# EAGLE board rtc (EAGLE 6.6.0), part 1 of 3
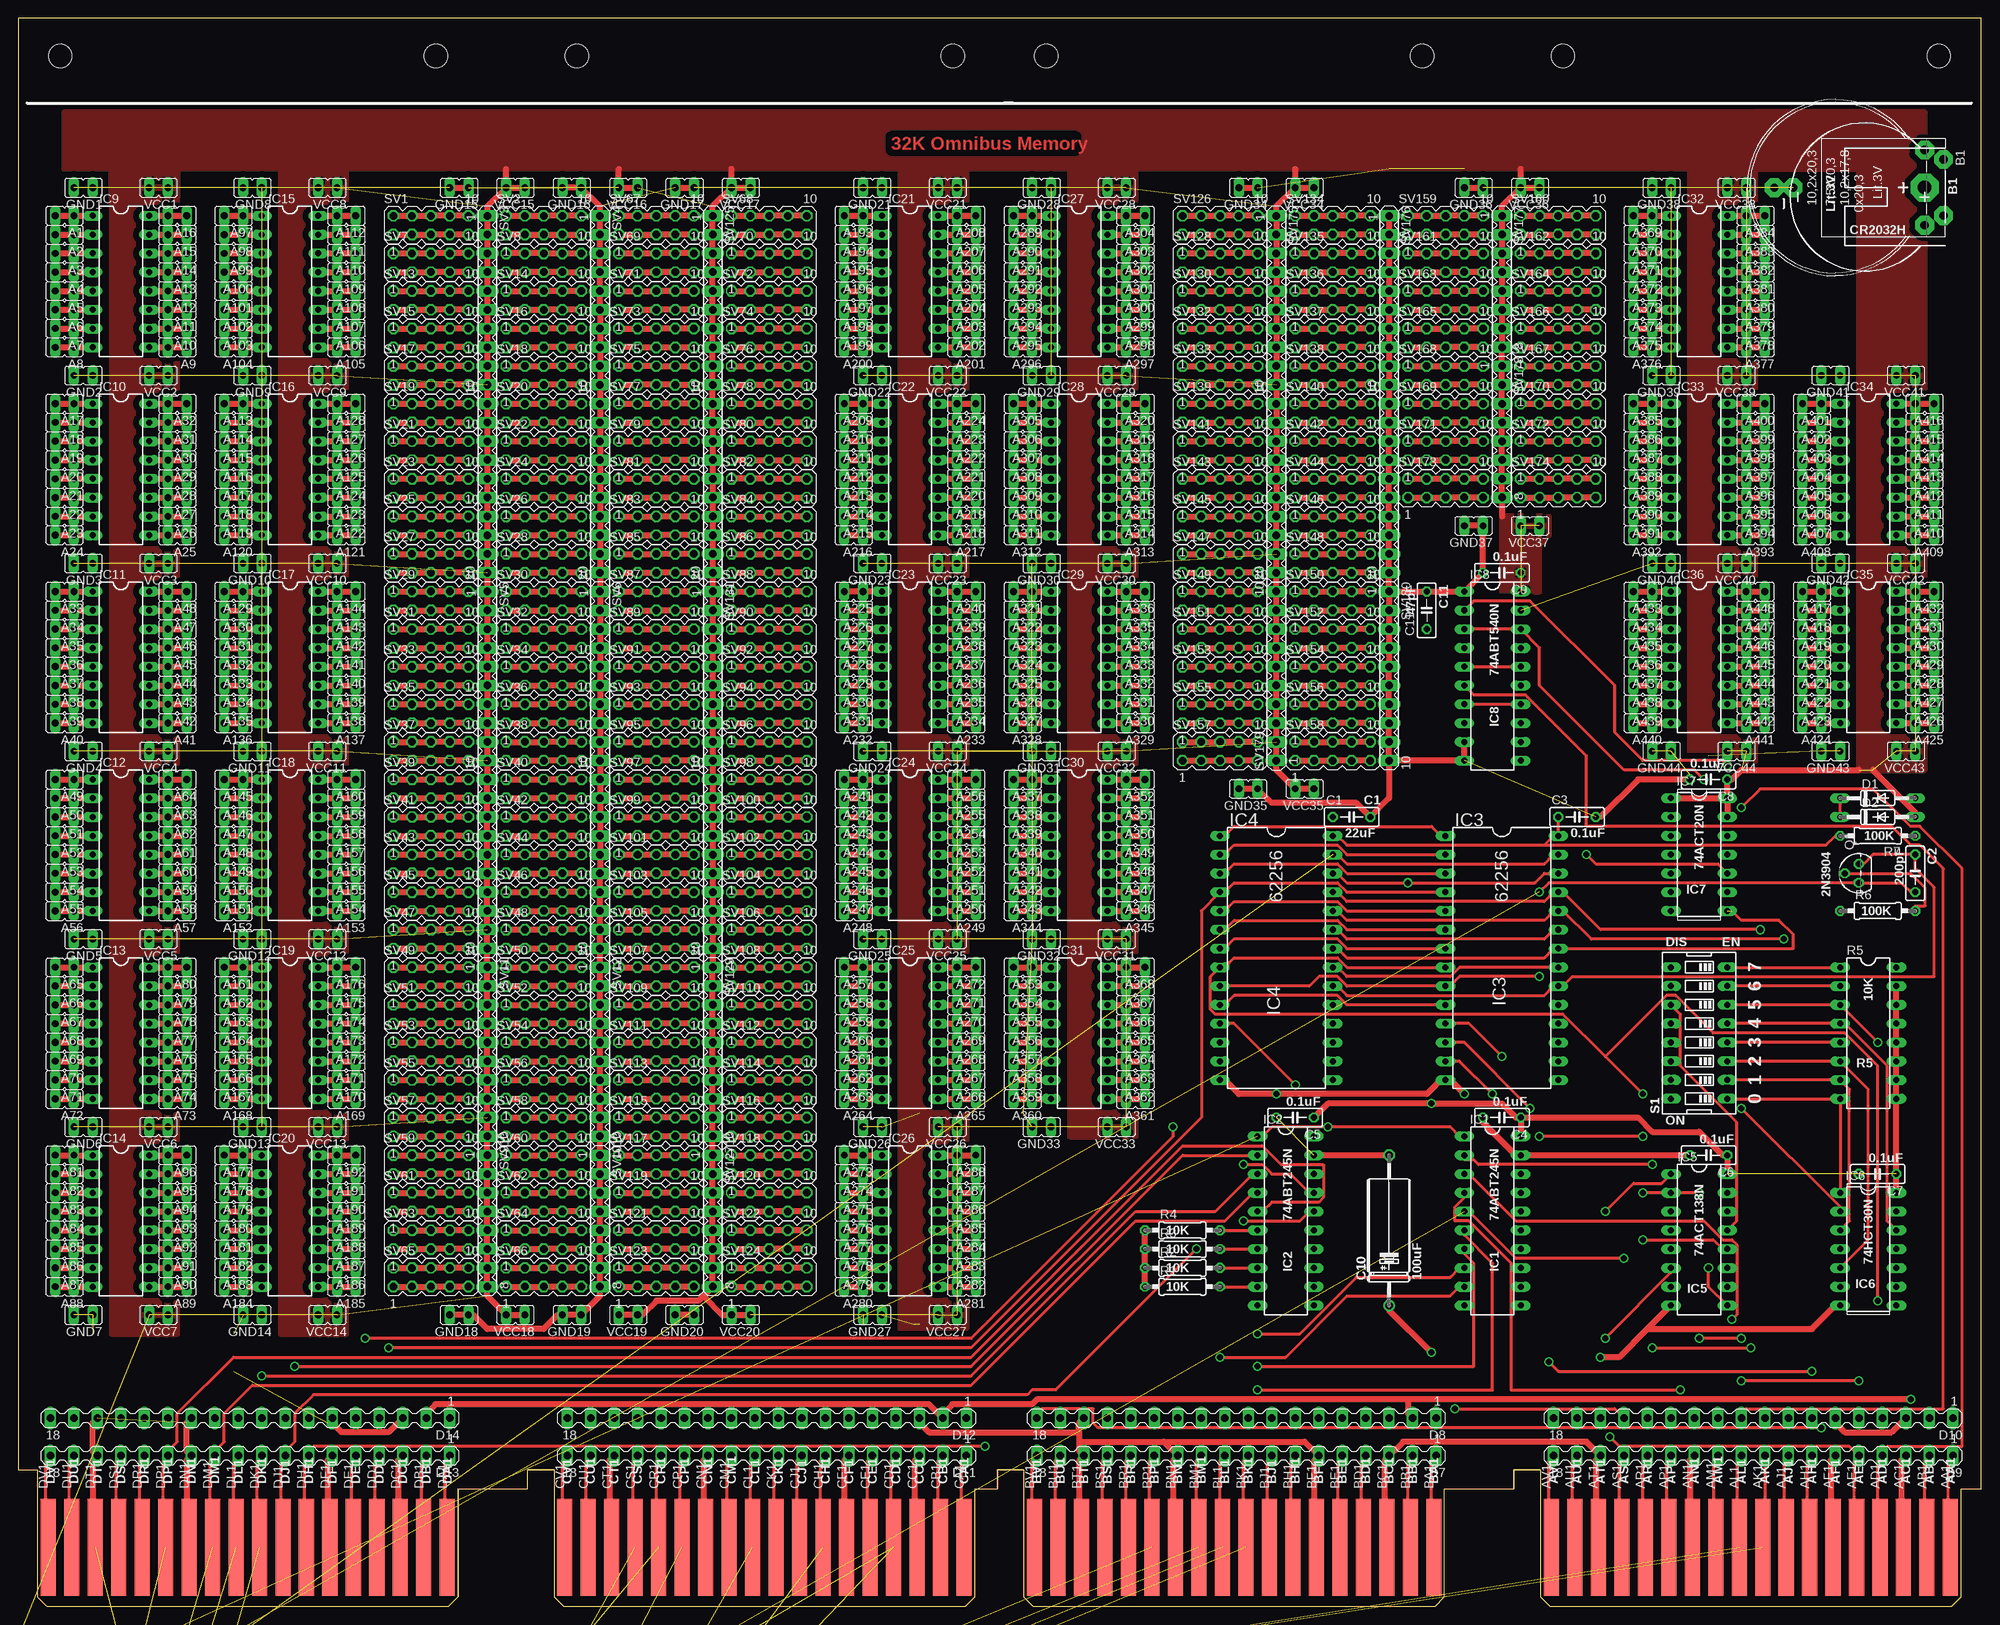
[diagram p6: board, top side]
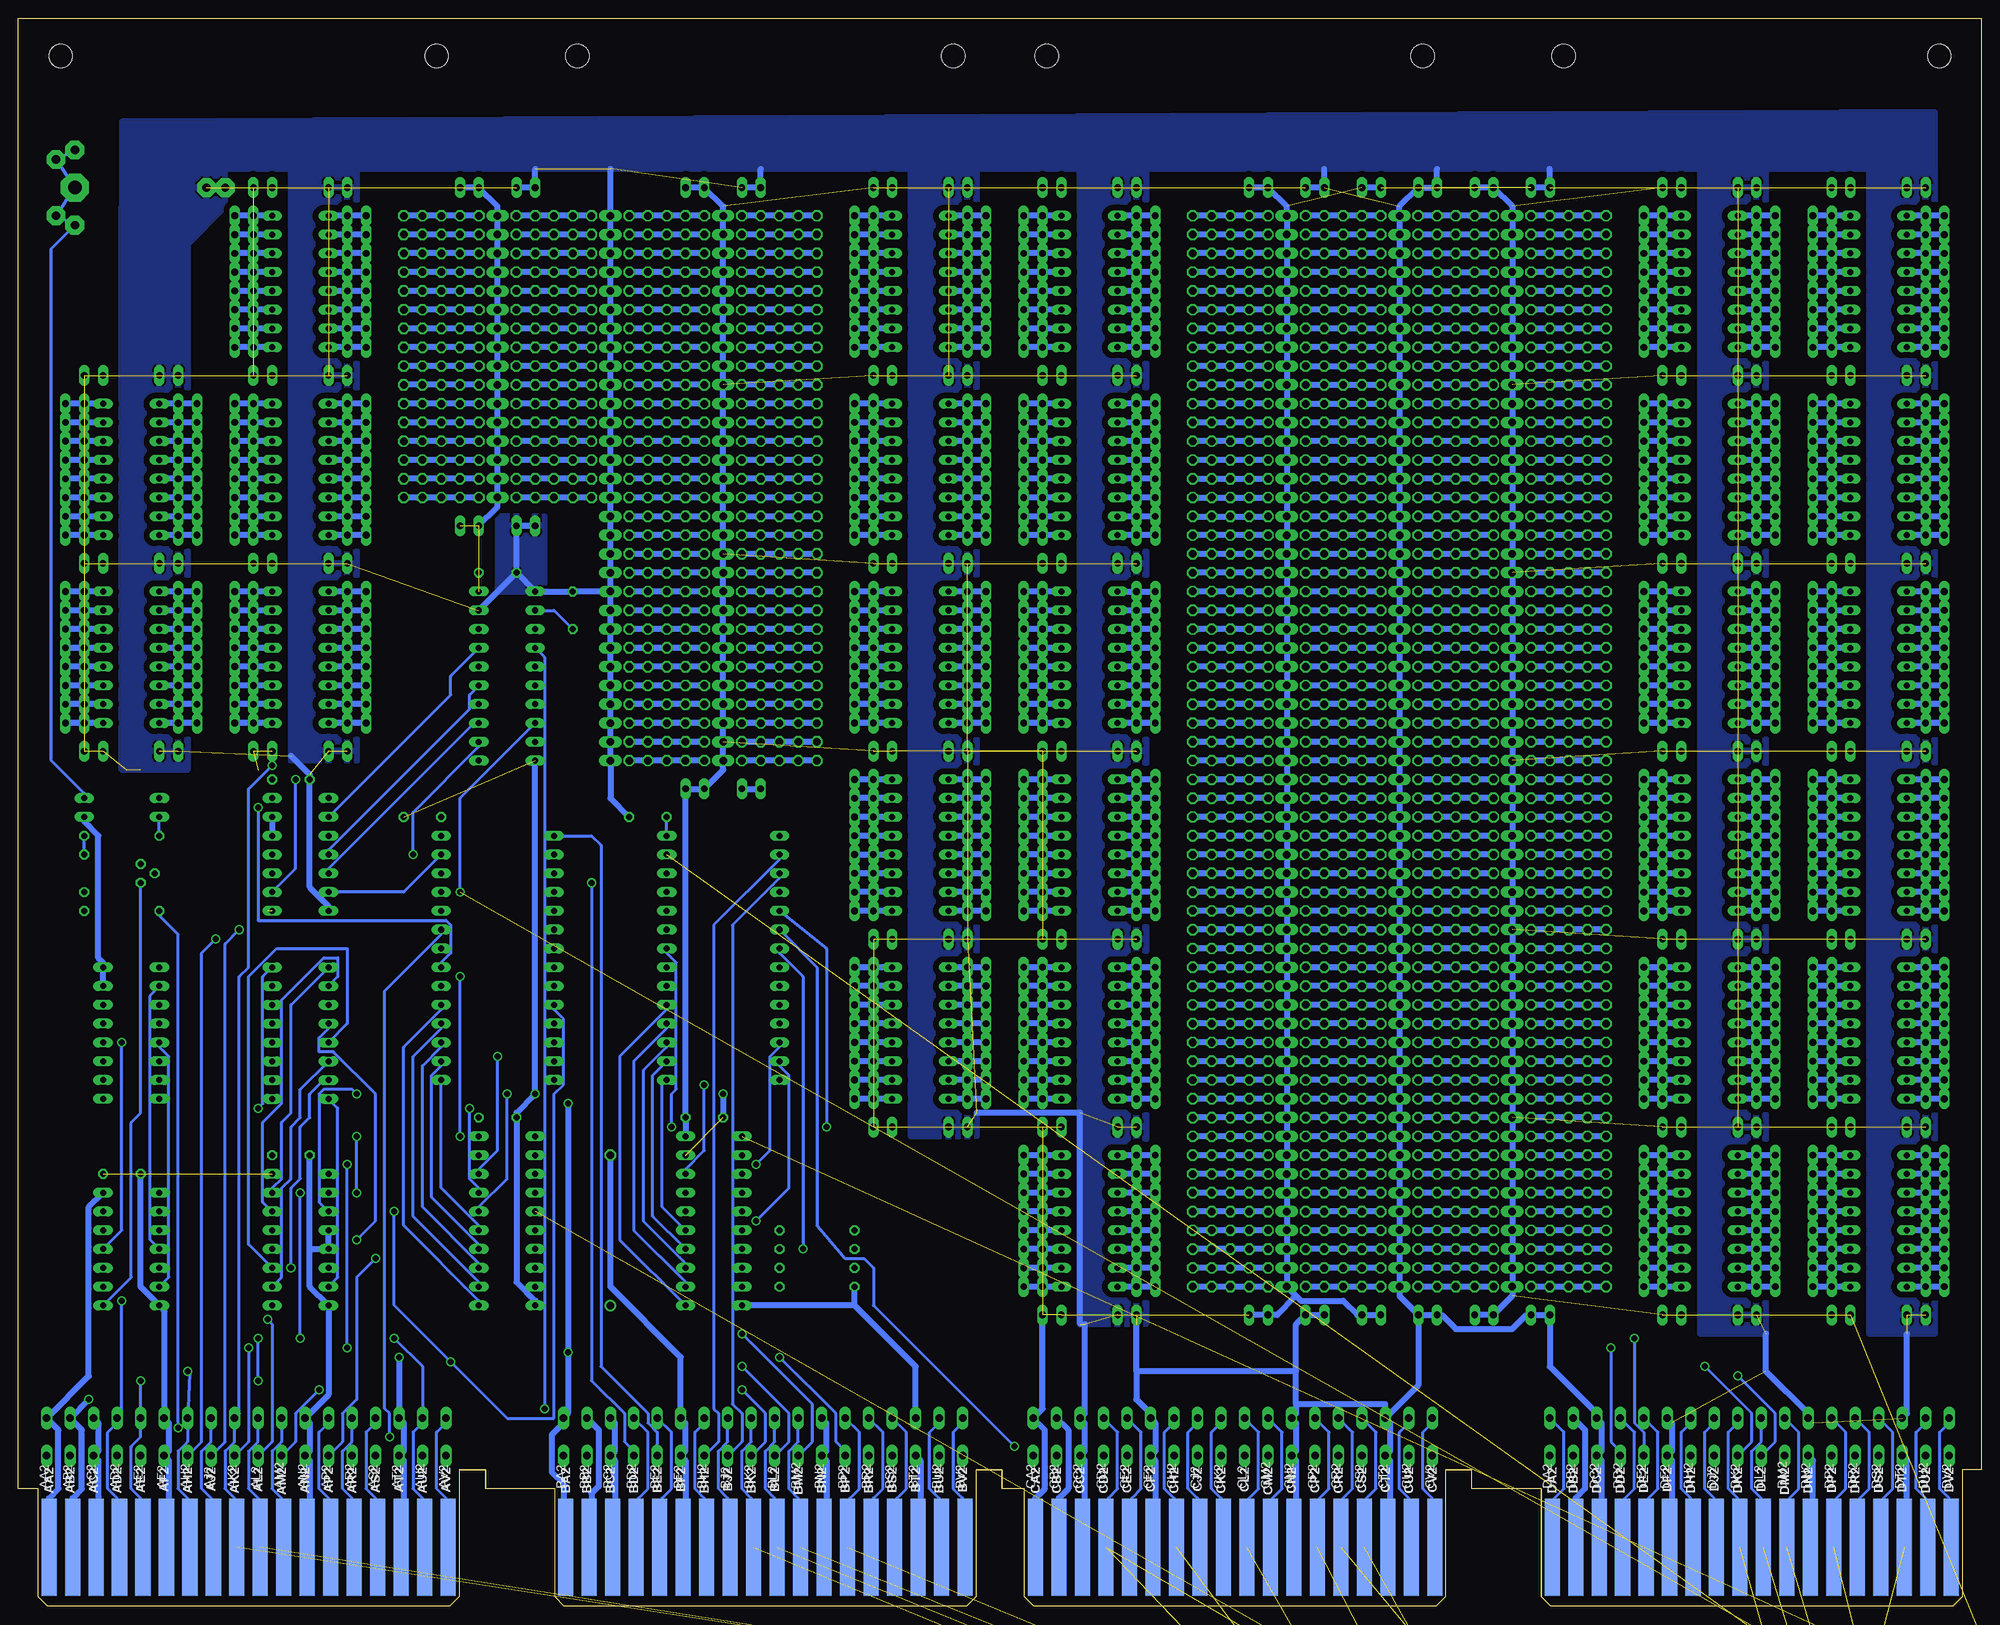
[diagram p7: board, bottom side, seen from below]

Size 265.3 x 214.63 mm. Coordinates in mm from the lower left corner, seen from the top.
Copper layers (1+16): Top 0.035mm / dielectric 1.5mm / Bottom 0.035mm
Design rules "16mils": minimum track width 16mil, minimum drill 32mil, track to track 15mil, track to pad 10mil, pad to pad 10mil, via to via 10mil, smd to smd 10mil, copper to edge 13mil, drill to drill 10mil, minimum pad ring 10mil, minimum via ring 8mil, stop-mask expansion 0mil, vias tented up to drill 0mil, thermal gap 10mil
Net classes: 1 supply: width 0.813 mm

## Footprints (pad centres in the part's own frame; a part is rotated, then mirrored left to right if it is on the bottom)
JP1 = drill 0.914 long: 1 0,-1.27; 2 0,1.27
B2430UNI = drill 1.118 pad 2.54 octagon: + 3.81,14.605; +@1 -3.81,14.605; +@2 -5.08,12.065; +@3 5.08,12.065; - 0,-5.715; -@1 0,-8.255 | drill 1.803 pad 3.81 octagon: +@4 0,12.065
C050-025X075 = drill 0.813 octagon: 1 -2.54,0; 2 2.54,0
E12-8 = drill 1.016: + -10.16,0 | drill 1.016 octagon: - 10.16,0
DO35-10 = drill 0.813 long: A 5.08,0; C -5.08,0
MA18-1 = drill 1.016 long: 1 -25.4,0; 2 -22.225,0; 3 -19.05,0; 4 -15.875,0; 5 -12.7,0; 6 -9.525,0; 7 -6.35,0; 8 -3.175,0; 9 0,0; 10 3.175,0; 11 6.35,0; 12 9.525,0; 13 12.7,0; 14 15.875,0; 15 19.05,0; 16 22.225,0; 17 25.4,0; 18 28.575,0
DIL20 = drill 0.813 long: 1 -11.43,-3.81; 2 -8.89,-3.81; 3 -6.35,-3.81; 4 -3.81,-3.81; 5 -1.27,-3.81; 6 1.27,-3.81; 7 3.81,-3.81; 8 6.35,-3.81; 9 8.89,-3.81; 10 11.43,-3.81; 11 11.43,3.81; 12 8.89,3.81; 13 6.35,3.81; 14 3.81,3.81; 15 1.27,3.81; 16 -1.27,3.81; 17 -3.81,3.81; 18 -6.35,3.81; 19 -8.89,3.81; 20 -11.43,3.81
DIL28-6 = drill 0.813 long: 1 -16.51,-7.62; 2 -13.97,-7.62; 3 -11.43,-7.62; 4 -8.89,-7.62; 5 -6.35,-7.62; 6 -3.81,-7.62; 7 -1.27,-7.62; 8 1.27,-7.62; 9 3.81,-7.62; 10 6.35,-7.62; 11 8.89,-7.62; 12 11.43,-7.62; 13 13.97,-7.62; 14 16.51,-7.62; 15 16.51,7.62; 16 13.97,7.62; 17 11.43,7.62; 18 8.89,7.62; 19 6.35,7.62; 20 3.81,7.62; 21 1.27,7.62; 22 -1.27,7.62; 23 -3.81,7.62; 24 -6.35,7.62; 25 -8.89,7.62; 26 -11.43,7.62; 27 -13.97,7.62; 28 -16.51,7.62
DIL16 = drill 0.813 long: 1 -8.89,-3.81; 2 -6.35,-3.81; 3 -3.81,-3.81; 4 -1.27,-3.81; 5 1.27,-3.81; 6 3.81,-3.81; 7 6.35,-3.81; 8 8.89,-3.81; 9 8.89,3.81; 10 6.35,3.81; 11 3.81,3.81; 12 1.27,3.81; 13 -1.27,3.81; 14 -3.81,3.81; 15 -6.35,3.81; 16 -8.89,3.81
DIL14 = drill 0.813 long: 1 -7.62,-3.81; 2 -5.08,-3.81; 3 -2.54,-3.81; 4 0,-3.81; 5 2.54,-3.81; 6 5.08,-3.81; 7 7.62,-3.81; 8 7.62,3.81; 9 5.08,3.81; 10 2.54,3.81; 11 0,3.81; 12 -2.54,3.81; 13 -5.08,3.81; 14 -7.62,3.81
DIL08 = drill 0.813 long: 1 -3.81,-3.81; 2 -1.27,-3.81; 3 1.27,-3.81; 4 3.81,-3.81; 5 3.81,3.81; 6 1.27,3.81; 7 -1.27,3.81; 8 -3.81,3.81
TO92 = drill 0.813 octagon: 1 1.27,0; 2 0,1.905; 3 -1.27,0
0207/10 = drill 0.813 octagon: 1 -5.08,0; 2 5.08,0
EDG-08 = drill 0.813 long: 1 -8.89,-3.81; 2 -6.35,-3.81; 3 -3.81,-3.81; 4 -1.27,-3.81; 5 1.27,-3.81; 6 3.81,-3.81; 7 6.35,-3.81; 8 8.89,-3.81; 9 8.89,3.81; 10 6.35,3.81; 11 3.81,3.81; 12 1.27,3.81; 13 -1.27,3.81; 14 -3.81,3.81; 15 -6.35,3.81; 16 -8.89,3.81
MA05-2 = drill 1.016 octagon: 1 -5.08,-1.27; 2 -5.08,1.27; 3 -2.54,-1.27; 4 -2.54,1.27; 5 0,-1.27; 6 0,1.27; 7 2.54,-1.27; 8 2.54,1.27; 9 5.08,-1.27; 10 5.08,1.27
MA20-1 = drill 1.016 long: 1 -24.13,0; 2 -21.59,0; 3 -19.05,0; 4 -16.51,0; 5 -13.97,0; 6 -11.43,0; 7 -8.89,0; 8 -6.35,0; 9 -3.81,0; 10 -1.27,0; 11 1.27,0; 12 3.81,0; 13 6.35,0; 14 8.89,0; 15 11.43,0; 16 13.97,0; 17 16.51,0; 18 19.05,0; 19 21.59,0; 20 24.13,0
MA08-1 = drill 1.016 long: 1 -8.89,0; 2 -6.35,0; 3 -3.81,0; 4 -1.27,0; 5 1.27,0; 6 3.81,0; 7 6.35,0; 8 8.89,0
MA10-1 = drill 1.016 long: 1 -11.43,0; 2 -8.89,0; 3 -6.35,0; 4 -3.81,0; 5 -1.27,0; 6 1.27,0; 7 3.81,0; 8 6.35,0; 9 8.89,0; 10 11.43,0
OMNIBUS = hole 3.175: 208.915,209.55; 259.715,209.55; 189.865,209.55; 139.065,209.55; 75.616,209.55; 126.416,209.55; 56.566,209.55; 5.766,209.55
EDGE-CON8 = smd 2.032 x 13.106: AA1 261.303,7.938; AB1 258.127,7.938; AC1 254.952,7.938; AD1 251.778,7.938; AE1 248.602,7.938; AF1 245.428,7.938; AH1 242.252,7.938; AJ1 239.077,7.938; AK1 235.903,7.938; AL1 232.727,7.938; AM1 229.553,7.938; AN1 226.377,7.938; AP1 223.202,7.938; AR1 220.028,7.938; AS1 216.852,7.938; AT1 213.678,7.938; AU1 210.502,7.938; AV1 207.327,7.938; BA1 191.452,7.938; BB1 188.278,7.938; BC1 185.102,7.938; BD1 181.928,7.938; BE1 178.752,7.938; BF1 175.577,7.938; BH1 172.403,7.938; BJ1 169.227,7.938; BK1 166.053,7.938; BL1 162.877,7.938; BM1 159.702,7.938; BN1 156.528,7.938; BP1 153.352,7.938; BR1 150.178,7.938; BS1 147.002,7.938; BT1 143.827,7.938; BU1 140.653,7.938; BV1 137.477,7.938; CA1 127.953,7.938; CB1 124.778,7.938; CC1 121.603,7.938; CD1 118.427,7.938; CE1 115.252,7.938; CF1 112.078,7.938; CH1 108.903,7.938; CJ1 105.728,7.938; CK1 102.552,7.938; CL1 99.377,7.938; CM1 96.203,7.938; CN1 93.028,7.938; CP1 89.853,7.938; CR1 86.677,7.938; CS1 83.502,7.938; CT1 80.328,7.938; CU1 77.153,7.938; CV1 73.978,7.938; DA1 58.102,7.938; DB1 54.928,7.938; DC1 51.752,7.938; DD1 48.578,7.938; DE1 45.403,7.938; DF1 42.227,7.938; DH1 39.053,7.938; DJ1 35.877,7.938; DK1 32.703,7.938; DL1 29.527,7.938; DM1 26.352,7.938; DN1 23.177,7.938; DP1 20.003,7.938; DR1 16.828,7.938; DS1 13.652,7.938; DT1 10.477,7.938; DU1 7.303,7.938; DV1 4.128,7.938 | smd 2.032 x 13.106 bottom: AA2 261.303,7.938; AB2 258.127,7.938; AC2 254.952,7.938; AD2 251.778,7.938; AE2 248.602,7.938; AF2 245.428,7.938; AH2 242.252,7.938; AJ2 239.077,7.938; AK2 235.903,7.938; AL2 232.727,7.938; AM2 229.553,7.938; AN2 226.377,7.938; AP2 223.202,7.938; AR2 220.028,7.938; AS2 216.852,7.938; AT2 213.678,7.938; AU2 210.502,7.938; AV2 207.327,7.938; BA2 191.452,7.938; BB2 188.278,7.938; BC2 185.102,7.938; BD2 181.928,7.938; BE2 178.752,7.938; BF2 175.577,7.938; BH2 172.403,7.938; BJ2 169.227,7.938; BK2 166.053,7.938; BL2 162.877,7.938; BM2 159.702,7.938; BN2 156.528,7.938; BP2 153.352,7.938; BR2 150.178,7.938; BS2 147.002,7.938; BT2 143.827,7.938; BU2 140.653,7.938; BV2 137.477,7.938; CA2 127.953,7.938; CB2 124.778,7.938; CC2 121.603,7.938; CD2 118.427,7.938; CE2 115.252,7.938; CF2 112.078,7.938; CH2 108.903,7.938; CJ2 105.728,7.938; CK2 102.552,7.938; CL2 99.377,7.938; CM2 96.203,7.938; CN2 93.028,7.938; CP2 89.853,7.938; CR2 86.677,7.938; CS2 83.502,7.938; CT2 80.328,7.938; CU2 77.153,7.938; CV2 73.978,7.938; DA2 58.102,7.938; DB2 54.928,7.938; DC2 51.752,7.938; DD2 48.578,7.938; DE2 45.403,7.938; DF2 42.227,7.938; DH2 39.053,7.938; DJ2 35.877,7.938; DK2 32.703,7.938; DL2 29.527,7.938; DM2 26.352,7.938; DN2 23.177,7.938; DP2 20.003,7.938; DR2 16.828,7.938; DS2 13.652,7.938; DT2 10.477,7.938; DU2 7.303,7.938; DV2 4.128,7.938

## Placement (x,y rotation side)
A1  [JP1]  6.22,187.96 90 top
A2  [JP1]  6.22,185.42 90 top
A3  [JP1]  6.22,182.88 90 top
A4  [JP1]  6.22,180.34 90 top
A5  [JP1]  6.22,177.8 90 top
A6  [JP1]  6.22,175.26 90 top
A7  [JP1]  6.22,172.72 90 top
A8  [JP1]  6.22,170.18 90 top
A9  [JP1]  21.46,170.18 90 top
A10  [JP1]  21.46,172.72 90 top
A11  [JP1]  21.46,175.26 90 top
A12  [JP1]  21.46,177.8 90 top
A13  [JP1]  21.46,180.34 90 top
A14  [JP1]  21.46,182.88 90 top
A15  [JP1]  21.46,185.42 90 top
A16  [JP1]  21.46,187.96 90 top
A17  [JP1]  6.22,162.56 90 top
A18  [JP1]  6.22,160.02 90 top
A19  [JP1]  6.22,157.48 90 top
A20  [JP1]  6.22,154.94 90 top
A21  [JP1]  6.22,152.4 90 top
A22  [JP1]  6.22,149.86 90 top
A23  [JP1]  6.22,147.32 90 top
A24  [JP1]  6.22,144.78 90 top
A25  [JP1]  21.46,144.78 90 top
A26  [JP1]  21.46,147.32 90 top
A27  [JP1]  21.46,149.86 90 top
A28  [JP1]  21.46,152.4 90 top
A29  [JP1]  21.46,154.94 90 top
A30  [JP1]  21.46,157.48 90 top
A31  [JP1]  21.46,160.02 90 top
A32  [JP1]  21.46,162.56 90 top
A33  [JP1]  6.22,137.16 90 top
A34  [JP1]  6.22,134.62 90 top
A35  [JP1]  6.22,132.08 90 top
A36  [JP1]  6.22,129.54 90 top
A37  [JP1]  6.22,127 90 top
A38  [JP1]  6.22,124.46 90 top
A39  [JP1]  6.22,121.92 90 top
A40  [JP1]  6.22,119.38 90 top
A41  [JP1]  21.46,119.38 90 top
A42  [JP1]  21.46,121.92 90 top
A43  [JP1]  21.46,124.46 90 top
A44  [JP1]  21.46,127 90 top
A45  [JP1]  21.46,129.54 90 top
A46  [JP1]  21.46,132.08 90 top
A47  [JP1]  21.46,134.62 90 top
A48  [JP1]  21.46,137.16 90 top
A49  [JP1]  6.22,111.76 90 top
A50  [JP1]  6.22,109.22 90 top
A51  [JP1]  6.22,106.68 90 top
A52  [JP1]  6.22,104.14 90 top
A53  [JP1]  6.22,101.6 90 top
A54  [JP1]  6.22,99.06 90 top
A55  [JP1]  6.22,96.52 90 top
A56  [JP1]  6.22,93.98 90 top
A57  [JP1]  21.46,93.98 90 top
A58  [JP1]  21.46,96.52 90 top
A59  [JP1]  21.46,99.06 90 top
A60  [JP1]  21.46,101.6 90 top
A61  [JP1]  21.46,104.14 90 top
A62  [JP1]  21.46,106.68 90 top
A63  [JP1]  21.46,109.22 90 top
A64  [JP1]  21.46,111.76 90 top
A65  [JP1]  6.22,86.36 90 top
A66  [JP1]  6.22,83.82 90 top
A67  [JP1]  6.22,81.28 90 top
A68  [JP1]  6.22,78.74 90 top
A69  [JP1]  6.22,76.2 90 top
A70  [JP1]  6.22,73.66 90 top
A71  [JP1]  6.22,71.12 90 top
A72  [JP1]  6.22,68.58 90 top
A73  [JP1]  21.46,68.58 90 top
A74  [JP1]  21.46,71.12 90 top
A75  [JP1]  21.46,73.66 90 top
A76  [JP1]  21.46,76.2 90 top
A77  [JP1]  21.46,78.74 90 top
A78  [JP1]  21.46,81.28 90 top
A79  [JP1]  21.46,83.82 90 top
A80  [JP1]  21.46,86.36 90 top
A81  [JP1]  6.22,60.96 90 top
A82  [JP1]  6.22,58.42 90 top
A83  [JP1]  6.22,55.88 90 top
A84  [JP1]  6.22,53.34 90 top
A85  [JP1]  6.22,50.8 90 top
A86  [JP1]  6.22,48.26 90 top
A87  [JP1]  6.22,45.72 90 top
A88  [JP1]  6.22,43.18 90 top
A89  [JP1]  21.46,43.18 90 top
A90  [JP1]  21.46,45.72 90 top
A91  [JP1]  21.46,48.26 90 top
A92  [JP1]  21.46,50.8 90 top
A93  [JP1]  21.46,53.34 90 top
A94  [JP1]  21.46,55.88 90 top
A95  [JP1]  21.46,58.42 90 top
A96  [JP1]  21.46,60.96 90 top
A97  [JP1]  29.08,187.96 90 top
A98  [JP1]  29.08,185.42 90 top
A99  [JP1]  29.08,182.88 90 top
A100  [JP1]  29.08,180.34 90 top
A101  [JP1]  29.08,177.8 90 top
A102  [JP1]  29.08,175.26 90 top
A103  [JP1]  29.08,172.72 90 top
A104  [JP1]  29.08,170.18 90 top
A105  [JP1]  44.32,170.18 90 top
A106  [JP1]  44.32,172.72 90 top
A107  [JP1]  44.32,175.26 90 top
A108  [JP1]  44.32,177.8 90 top
A109  [JP1]  44.32,180.34 90 top
A110  [JP1]  44.32,182.88 90 top
A111  [JP1]  44.32,185.42 90 top
A112  [JP1]  44.32,187.96 90 top
A113  [JP1]  29.08,162.56 90 top
A114  [JP1]  29.08,160.02 90 top
A115  [JP1]  29.08,157.48 90 top
A116  [JP1]  29.08,154.94 90 top
A117  [JP1]  29.08,152.4 90 top
A118  [JP1]  29.08,149.86 90 top
A119  [JP1]  29.08,147.32 90 top
A120  [JP1]  29.08,144.78 90 top
A121  [JP1]  44.32,144.78 90 top
A122  [JP1]  44.32,147.32 90 top
A123  [JP1]  44.32,149.86 90 top
A124  [JP1]  44.32,152.4 90 top
A125  [JP1]  44.32,154.94 90 top
A126  [JP1]  44.32,157.48 90 top
A127  [JP1]  44.32,160.02 90 top
A128  [JP1]  44.32,162.56 90 top
A129  [JP1]  29.08,137.16 90 top
A130  [JP1]  29.08,134.62 90 top
A131  [JP1]  29.08,132.08 90 top
A132  [JP1]  29.08,129.54 90 top
A133  [JP1]  29.08,127 90 top
A134  [JP1]  29.08,124.46 90 top
A135  [JP1]  29.08,121.92 90 top
A136  [JP1]  29.08,119.38 90 top
A137  [JP1]  44.32,119.38 90 top
A138  [JP1]  44.32,121.92 90 top
A139  [JP1]  44.32,124.46 90 top
A140  [JP1]  44.32,127 90 top
A141  [JP1]  44.32,129.54 90 top
A142  [JP1]  44.32,132.08 90 top
A143  [JP1]  44.32,134.62 90 top
A144  [JP1]  44.32,137.16 90 top
A145  [JP1]  29.08,111.76 90 top
A146  [JP1]  29.08,109.22 90 top
A147  [JP1]  29.08,106.68 90 top
A148  [JP1]  29.08,104.14 90 top
A149  [JP1]  29.08,101.6 90 top
A150  [JP1]  29.08,99.06 90 top
A151  [JP1]  29.08,96.52 90 top
A152  [JP1]  29.08,93.98 90 top
A153  [JP1]  44.32,93.98 90 top
A154  [JP1]  44.32,96.52 90 top
A155  [JP1]  44.32,99.06 90 top
A156  [JP1]  44.32,101.6 90 top
A157  [JP1]  44.32,104.14 90 top
A158  [JP1]  44.32,106.68 90 top
A159  [JP1]  44.32,109.22 90 top
A160  [JP1]  44.32,111.76 90 top
A161  [JP1]  29.08,86.36 90 top
A162  [JP1]  29.08,83.82 90 top
A163  [JP1]  29.08,81.28 90 top
A164  [JP1]  29.08,78.74 90 top
A165  [JP1]  29.08,76.2 90 top
A166  [JP1]  29.08,73.66 90 top
A167  [JP1]  29.08,71.12 90 top
A168  [JP1]  29.08,68.58 90 top
A169  [JP1]  44.32,68.58 90 top
A170  [JP1]  44.32,71.12 90 top
A171  [JP1]  44.32,73.66 90 top
A172  [JP1]  44.32,76.2 90 top
A173  [JP1]  44.32,78.74 90 top
A174  [JP1]  44.32,81.28 90 top
A175  [JP1]  44.32,83.82 90 top
A176  [JP1]  44.32,86.36 90 top
A177  [JP1]  29.08,60.96 90 top
A178  [JP1]  29.08,58.42 90 top
A179  [JP1]  29.08,55.88 90 top
A180  [JP1]  29.08,53.34 90 top
A181  [JP1]  29.08,50.8 90 top
A182  [JP1]  29.08,48.26 90 top
A183  [JP1]  29.08,45.72 90 top
A184  [JP1]  29.08,43.18 90 top
A185  [JP1]  44.32,43.18 90 top
A186  [JP1]  44.32,45.72 90 top
A187  [JP1]  44.32,48.26 90 top
A188  [JP1]  44.32,50.8 90 top
A189  [JP1]  44.32,53.34 90 top
A190  [JP1]  44.32,55.88 90 top
A191  [JP1]  44.32,58.42 90 top
A192  [JP1]  44.32,60.96 90 top
A193  [JP1]  112.9,187.96 90 top
A194  [JP1]  112.9,185.42 90 top
A195  [JP1]  112.9,182.88 90 top
A196  [JP1]  112.9,180.34 90 top
A197  [JP1]  112.9,177.8 90 top
A198  [JP1]  112.9,175.26 90 top
A199  [JP1]  112.9,172.72 90 top
A200  [JP1]  112.9,170.18 90 top
A201  [JP1]  128.14,170.18 90 top
A202  [JP1]  128.14,172.72 90 top
A203  [JP1]  128.14,175.26 90 top
A204  [JP1]  128.14,177.8 90 top
A205  [JP1]  128.14,180.34 90 top
A206  [JP1]  128.14,182.88 90 top
A207  [JP1]  128.14,185.42 90 top
A208  [JP1]  128.14,187.96 90 top
A209  [JP1]  112.9,162.56 90 top
A210  [JP1]  112.9,160.02 90 top
A211  [JP1]  112.9,157.48 90 top
A212  [JP1]  112.9,154.94 90 top
A213  [JP1]  112.9,152.4 90 top
A214  [JP1]  112.9,149.86 90 top
A215  [JP1]  112.9,147.32 90 top
A216  [JP1]  112.9,144.78 90 top
A217  [JP1]  128.14,144.78 90 top
A218  [JP1]  128.14,147.32 90 top
A219  [JP1]  128.14,149.86 90 top
A220  [JP1]  128.14,152.4 90 top
A221  [JP1]  128.14,154.94 90 top
A222  [JP1]  128.14,157.48 90 top
A223  [JP1]  128.14,160.02 90 top
A224  [JP1]  128.14,162.56 90 top
A225  [JP1]  112.9,137.16 90 top
A226  [JP1]  112.9,134.62 90 top
A227  [JP1]  112.9,132.08 90 top
A228  [JP1]  112.9,129.54 90 top
A229  [JP1]  112.9,127 90 top
A230  [JP1]  112.9,124.46 90 top
A231  [JP1]  112.9,121.92 90 top
A232  [JP1]  112.9,119.38 90 top
A233  [JP1]  128.14,119.38 90 top
A234  [JP1]  128.14,121.92 90 top
A235  [JP1]  128.14,124.46 90 top
A236  [JP1]  128.14,127 90 top
A237  [JP1]  128.14,129.54 90 top
A238  [JP1]  128.14,132.08 90 top
A239  [JP1]  128.14,134.62 90 top
A240  [JP1]  128.14,137.16 90 top
A241  [JP1]  112.9,111.76 90 top
A242  [JP1]  112.9,109.22 90 top
A243  [JP1]  112.9,106.68 90 top
A244  [JP1]  112.9,104.14 90 top
A245  [JP1]  112.9,101.6 90 top
A246  [JP1]  112.9,99.06 90 top
A247  [JP1]  112.9,96.52 90 top
A248  [JP1]  112.9,93.98 90 top
A249  [JP1]  128.14,93.98 90 top
A250  [JP1]  128.14,96.52 90 top
A251  [JP1]  128.14,99.06 90 top
A252  [JP1]  128.14,101.6 90 top
A253  [JP1]  128.14,104.14 90 top
A254  [JP1]  128.14,106.68 90 top
A255  [JP1]  128.14,109.22 90 top
A256  [JP1]  128.14,111.76 90 top
A257  [JP1]  112.9,86.36 90 top
A258  [JP1]  112.9,83.82 90 top
A259  [JP1]  112.9,81.28 90 top
A260  [JP1]  112.9,78.74 90 top
A261  [JP1]  112.9,76.2 90 top
A262  [JP1]  112.9,73.66 90 top
A263  [JP1]  112.9,71.12 90 top
A264  [JP1]  112.9,68.58 90 top
A265  [JP1]  128.14,68.58 90 top
A266  [JP1]  128.14,71.12 90 top
A267  [JP1]  128.14,73.66 90 top
A268  [JP1]  128.14,76.2 90 top
A269  [JP1]  128.14,78.74 90 top
A270  [JP1]  128.14,81.28 90 top
A271  [JP1]  128.14,83.82 90 top
A272  [JP1]  128.14,86.36 90 top
A273  [JP1]  112.9,60.96 90 top
A274  [JP1]  112.9,58.42 90 top
A275  [JP1]  112.9,55.88 90 top
A276  [JP1]  112.9,53.34 90 top
A277  [JP1]  112.9,50.8 90 top
A278  [JP1]  112.9,48.26 90 top
A279  [JP1]  112.9,45.72 90 top
A280  [JP1]  112.9,43.18 90 top
A281  [JP1]  128.14,43.18 90 top
A282  [JP1]  128.14,45.72 90 top
A283  [JP1]  128.14,48.26 90 top
A284  [JP1]  128.14,50.8 90 top
A285  [JP1]  128.14,53.34 90 top
A286  [JP1]  128.14,55.88 90 top
A287  [JP1]  128.14,58.42 90 top
A288  [JP1]  128.14,60.96 90 top
A289  [JP1]  135.76,187.96 90 top
A290  [JP1]  135.76,185.42 90 top
A291  [JP1]  135.76,182.88 90 top
A292  [JP1]  135.76,180.34 90 top
A293  [JP1]  135.76,177.8 90 top
A294  [JP1]  135.76,175.26 90 top
A295  [JP1]  135.76,172.72 90 top
A296  [JP1]  135.76,170.18 90 top
A297  [JP1]  151,170.18 90 top
A298  [JP1]  151,172.72 90 top
A299  [JP1]  151,175.26 90 top
A300  [JP1]  151,177.8 90 top
A301  [JP1]  151,180.34 90 top
A302  [JP1]  151,182.88 90 top
A303  [JP1]  151,185.42 90 top
A304  [JP1]  151,187.96 90 top
A305  [JP1]  135.76,162.56 90 top
A306  [JP1]  135.76,160.02 90 top
A307  [JP1]  135.76,157.48 90 top
A308  [JP1]  135.76,154.94 90 top
A309  [JP1]  135.76,152.4 90 top
A310  [JP1]  135.76,149.86 90 top
A311  [JP1]  135.76,147.32 90 top
A312  [JP1]  135.76,144.78 90 top
A313  [JP1]  151,144.78 90 top
A314  [JP1]  151,147.32 90 top
A315  [JP1]  151,149.86 90 top
A316  [JP1]  151,152.4 90 top
A317  [JP1]  151,154.94 90 top
A318  [JP1]  151,157.48 90 top
A319  [JP1]  151,160.02 90 top
A320  [JP1]  151,162.56 90 top
A321  [JP1]  135.76,137.16 90 top
A322  [JP1]  135.76,134.62 90 top
A323  [JP1]  135.76,132.08 90 top
A324  [JP1]  135.76,129.54 90 top
A325  [JP1]  135.76,127 90 top
A326  [JP1]  135.76,124.46 90 top
A327  [JP1]  135.76,121.92 90 top
A328  [JP1]  135.76,119.38 90 top
A329  [JP1]  151,119.38 90 top
A330  [JP1]  151,121.92 90 top
A331  [JP1]  151,124.46 90 top
A332  [JP1]  151,127 90 top
A333  [JP1]  151,129.54 90 top
A334  [JP1]  151,132.08 90 top
A335  [JP1]  151,134.62 90 top
A336  [JP1]  151,137.16 90 top
A337  [JP1]  135.76,111.76 90 top
A338  [JP1]  135.76,109.22 90 top
A339  [JP1]  135.76,106.68 90 top
A340  [JP1]  135.76,104.14 90 top
A341  [JP1]  135.76,101.6 90 top
A342  [JP1]  135.76,99.06 90 top
A343  [JP1]  135.76,96.52 90 top
A344  [JP1]  135.76,93.98 90 top
A345  [JP1]  151,93.98 90 top
A346  [JP1]  151,96.52 90 top
A347  [JP1]  151,99.06 90 top
A348  [JP1]  151,101.6 90 top
A349  [JP1]  151,104.14 90 top
A350  [JP1]  151,106.68 90 top
A351  [JP1]  151,109.22 90 top
A352  [JP1]  151,111.76 90 top
A353  [JP1]  135.76,86.36 90 top
A354  [JP1]  135.76,83.82 90 top
A355  [JP1]  135.76,81.28 90 top
A356  [JP1]  135.76,78.74 90 top
A357  [JP1]  135.76,76.2 90 top
A358  [JP1]  135.76,73.66 90 top
A359  [JP1]  135.76,71.12 90 top
A360  [JP1]  135.76,68.58 90 top
A361  [JP1]  151,68.58 90 top
A362  [JP1]  151,71.12 90 top
A363  [JP1]  151,73.66 90 top
A364  [JP1]  151,76.2 90 top
A365  [JP1]  151,78.74 90 top
A366  [JP1]  151,81.28 90 top
A367  [JP1]  151,83.82 90 top
A368  [JP1]  151,86.36 90 top
A369  [JP1]  219.58,187.96 90 top
A370  [JP1]  219.58,185.42 90 top
A371  [JP1]  219.58,182.88 90 top
A372  [JP1]  219.58,180.34 90 top
A373  [JP1]  219.58,177.8 90 top
A374  [JP1]  219.58,175.26 90 top
A375  [JP1]  219.58,172.72 90 top
A376  [JP1]  219.58,170.18 90 top
A377  [JP1]  234.82,170.18 90 top
A378  [JP1]  234.82,172.72 90 top
A379  [JP1]  234.82,175.26 90 top
A380  [JP1]  234.82,177.8 90 top
A381  [JP1]  234.82,180.34 90 top
A382  [JP1]  234.82,182.88 90 top
A383  [JP1]  234.82,185.42 90 top
A384  [JP1]  234.82,187.96 90 top
A385  [JP1]  219.58,162.56 90 top
A386  [JP1]  219.58,160.02 90 top
A387  [JP1]  219.58,157.48 90 top
A388  [JP1]  219.58,154.94 90 top
A389  [JP1]  219.58,152.4 90 top
A390  [JP1]  219.58,149.86 90 top
A391  [JP1]  219.58,147.32 90 top
A392  [JP1]  219.58,144.78 90 top
A393  [JP1]  234.82,144.78 90 top
A394  [JP1]  234.82,147.32 90 top
A395  [JP1]  234.82,149.86 90 top
A396  [JP1]  234.82,152.4 90 top
A397  [JP1]  234.82,154.94 90 top
A398  [JP1]  234.82,157.48 90 top
A399  [JP1]  234.82,160.02 90 top
A400  [JP1]  234.82,162.56 90 top
A401  [JP1]  242.44,162.56 90 top
A402  [JP1]  242.44,160.02 90 top
A403  [JP1]  242.44,157.48 90 top
A404  [JP1]  242.44,154.94 90 top
A405  [JP1]  242.44,152.4 90 top
A406  [JP1]  242.44,149.86 90 top
A407  [JP1]  242.44,147.32 90 top
A408  [JP1]  242.44,144.78 90 top
A409  [JP1]  257.68,144.78 90 top
A410  [JP1]  257.68,147.32 90 top
A411  [JP1]  257.68,149.86 90 top
A412  [JP1]  257.68,152.4 90 top
A413  [JP1]  257.68,154.94 90 top
A414  [JP1]  257.68,157.48 90 top
A415  [JP1]  257.68,160.02 90 top
A416  [JP1]  257.68,162.56 90 top
A417  [JP1]  242.44,137.16 90 top
A418  [JP1]  242.44,134.62 90 top
A419  [JP1]  242.44,132.08 90 top
A420  [JP1]  242.44,129.54 90 top
A421  [JP1]  242.44,127 90 top
A422  [JP1]  242.44,124.46 90 top
A423  [JP1]  242.44,121.92 90 top
A424  [JP1]  242.44,119.38 90 top
A425  [JP1]  257.68,119.38 90 top
A426  [JP1]  257.68,121.92 90 top
A427  [JP1]  257.68,124.46 90 top
A428  [JP1]  257.68,127 90 top
A429  [JP1]  257.68,129.54 90 top
A430  [JP1]  257.68,132.08 90 top
A431  [JP1]  257.68,134.62 90 top
A432  [JP1]  257.68,137.16 90 top
A433  [JP1]  219.58,137.16 90 top
A434  [JP1]  219.58,134.62 90 top
A435  [JP1]  219.58,132.08 90 top
A436  [JP1]  219.58,129.54 90 top
A437  [JP1]  219.58,127 90 top
A438  [JP1]  219.58,124.46 90 top
A439  [JP1]  219.58,121.92 90 top
A440  [JP1]  219.58,119.38 90 top
A441  [JP1]  234.82,119.38 90 top
A442  [JP1]  234.82,121.92 90 top
A443  [JP1]  234.82,124.46 90 top
A444  [JP1]  234.82,127 90 top
A445  [JP1]  234.82,129.54 90 top
A446  [JP1]  234.82,132.08 90 top
A447  [JP1]  234.82,134.62 90 top
A448  [JP1]  234.82,137.16 90 top
B1  CR2032  [B2430UNI]  245.62,191.77 270 top
C1  22uF  [C050-025X075]  180.21,106.68 0 top
C2  200pF  [C050-025X075]  256.41,99.06 270 top
C3  0.1uF  [C050-025X075]  210.69,106.68 0 top
C4  0.1uF  [C050-025X075]  200.53,66.04 180 top
C5  0.1uF  [C050-025X075]  172.59,66.04 180 top
C6  0.1uF  [C050-025X075]  228.47,60.96 180 top
C7  0.1uF  [C050-025X075]  251.33,58.42 180 top
C8  0.1uF  [C050-025X075]  228.47,111.76 180 top
C9  0.1uF  [C050-025X075]  200.53,139.7 180 top
C10  100uF  [E12-8]  185.29,50.8 90 top
C11  47pF  [C050-025X075]  190.37,134.62 90 top
D1  [DO35-10]  251.33,109.22 0 top
D2  [DO35-10]  251.33,106.68 0 top
D7  MA18-1  [MA18-1]  166.24,20.32 180 top
D8  MA18-1  [MA18-1]  166.24,25.4 180 top
D9  MA18-1  [MA18-1]  236.09,20.32 180 top
D10  MA18-1  [MA18-1]  236.09,25.4 180 top
D11  MA18-1  [MA18-1]  102.74,20.32 180 top
D12  MA18-1  [MA18-1]  102.74,25.4 180 top
D13  MA18-1  [MA18-1]  32.89,20.32 180 top
D14  MA18-1  [MA18-1]  32.89,25.4 180 top
GND1  [JP1]  8.76,191.77 90 top
GND2  [JP1]  8.76,166.37 90 top
GND3  [JP1]  8.76,140.97 90 top
GND4  [JP1]  8.76,115.57 90 top
GND5  [JP1]  8.76,90.17 90 top
GND6  [JP1]  8.76,64.77 90 top
GND7  [JP1]  8.76,39.37 90 top
GND8  [JP1]  31.62,191.77 90 top
GND9  [JP1]  31.62,166.37 90 top
GND10  [JP1]  31.62,140.97 90 top
GND11  [JP1]  31.62,115.57 90 top
GND12  [JP1]  31.62,90.17 90 top
GND13  [JP1]  31.62,64.77 90 top
GND14  [JP1]  31.62,39.37 90 top
GND15  [JP1]  59.56,191.77 90 top
GND16  [JP1]  74.8,191.77 90 top
GND17  [JP1]  90.04,191.77 90 top
GND18  [JP1]  59.56,39.37 90 top
GND19  [JP1]  74.8,39.37 90 top
GND20  [JP1]  90.04,39.37 90 top
GND21  [JP1]  115.44,191.77 90 top
GND22  [JP1]  115.44,166.37 90 top
GND23  [JP1]  115.44,140.97 90 top
GND24  [JP1]  115.44,115.57 90 top
GND25  [JP1]  115.44,90.17 90 top
GND26  [JP1]  115.44,64.77 90 top
GND27  [JP1]  115.44,39.37 90 top
GND28  [JP1]  138.3,191.77 90 top
GND29  [JP1]  138.3,166.37 90 top
GND30  [JP1]  138.3,140.97 90 top
GND31  [JP1]  138.3,115.57 90 top
GND32  [JP1]  138.3,90.17 90 top
GND33  [JP1]  138.3,64.77 90 top
GND34  [JP1]  166.24,191.77 90 top
GND35  [JP1]  166.24,110.49 90 top
GND36  [JP1]  196.72,191.77 90 top
GND37  [JP1]  196.72,146.05 90 top
GND38  [JP1]  222.12,191.77 90 top
GND39  [JP1]  222.12,166.37 90 top
GND40  [JP1]  222.12,140.97 90 top
GND41  [JP1]  244.98,166.37 90 top
GND42  [JP1]  244.98,140.97 90 top
GND43  [JP1]  244.98,115.57 90 top
GND44  [JP1]  222.12,115.57 90 top
IC1  74ABT245N  [DIL20]  199.26,52.07 270 top
IC2  74ABT245N  [DIL20]  171.32,52.07 270 top
IC3  62256  [DIL28-6]  200.53,87.63 270 top
IC4  62256  [DIL28-6]  170.05,87.63 270 top
IC5  74ACT138N  [DIL16]  227.2,49.53 270 top
IC6  74HCT30N  [DIL14]  250.06,48.26 270 top
IC7  74ACT20N  [DIL14]  227.2,101.6 270 top
IC8  74ABT540N  [DIL20]  199.26,125.73 270 top
IC9  [DIL16]  13.84,179.07 270 top
IC10  [DIL16]  13.84,153.67 270 top
IC11  [DIL16]  13.84,128.27 270 top
IC12  [DIL16]  13.84,102.87 270 top
IC13  [DIL16]  13.84,77.47 270 top
IC14  [DIL16]  13.84,52.07 270 top
IC15  [DIL16]  36.7,179.07 270 top
IC16  [DIL16]  36.7,153.67 270 top
IC17  [DIL16]  36.7,128.27 270 top
IC18  [DIL16]  36.7,102.87 270 top
IC19  [DIL16]  36.7,77.47 270 top
IC20  [DIL16]  36.7,52.07 270 top
IC21  [DIL16]  120.52,179.07 270 top
IC22  [DIL16]  120.52,153.67 270 top
IC23  [DIL16]  120.52,128.27 270 top
IC24  [DIL16]  120.52,102.87 270 top
IC25  [DIL16]  120.52,77.47 270 top
IC26  [DIL16]  120.52,52.07 270 top
IC27  [DIL16]  143.38,179.07 270 top
IC28  [DIL16]  143.38,153.67 270 top
IC29  [DIL16]  143.38,128.27 270 top
IC30  [DIL16]  143.38,102.87 270 top
IC31  [DIL16]  143.38,77.47 270 top
IC32  [DIL16]  227.2,179.07 270 top
IC33  [DIL16]  227.2,153.67 270 top
IC34  [DIL16]  250.06,153.67 270 top
IC35  [DIL16]  250.06,128.27 270 top
IC36  [DIL16]  227.2,128.27 270 top
IC37  74ACT138N  [DIL16]  7.49,-11.43 0 top  (outside the outline)
IC38  74LS139N  [DIL16]  7.49,-31.75 0 top  (outside the outline)
IC39  74ACT138N  [DIL16]  7.49,-52.07 0 top  (outside the outline)
IC40  74ACT138N  [DIL16]  7.49,-72.39 0 top  (outside the outline)
IC41  74ACT74N  [DIL14]  6.22,-92.71 0 top  (outside the outline)
IC42  74ACT74N  [DIL14]  6.22,-113.03 0 top  (outside the outline)
IC43  DS75452N  [DIL08]  2.41,-133.35 0 top  (outside the outline)
IC45  DS75453N  [DIL08]  15.11,-133.35 0 top  (outside the outline)
Q1  2N3904  [TO92]  248.79,99.06 90 top
R1  10K  [0207/10]  157.35,43.18 0 top
R2  10K  [0207/10]  157.35,45.72 0 top
R3  10K  [0207/10]  157.35,48.26 0 top
R4  10K  [0207/10]  157.35,50.8 0 top
R5  10K  [DIL16]  250.06,77.47 270 top
R6  100K  [0207/10]  251.33,93.98 0 top
R7  100K  [0207/10]  251.33,104.14 180 top
S1  [EDG-08]  227.2,77.47 90 top
SV1  [MA05-2]  55.75,186.69 0 top
SV2  [MA05-2]  70.99,186.69 0 top
SV3  [MA20-1]  63.37,163.83 270 top
SV4  [MA20-1]  78.61,163.83 270 top
SV5  [MA20-1]  63.37,113.03 270 top
SV6  [MA20-1]  78.61,113.03 270 top
SV7  [MA05-2]  55.75,181.61 0 top
SV8  [MA05-2]  70.99,181.61 0 top
SV9  [MA08-1]  63.37,52.07 270 top
SV10  [MA08-1]  78.61,52.07 270 top
SV11  [MA10-1]  63.37,74.93 270 top
SV12  [MA10-1]  78.61,74.93 270 top
SV13  [MA05-2]  55.75,176.53 0 top
SV14  [MA05-2]  70.99,176.53 0 top
SV15  [MA05-2]  55.75,171.45 0 top
SV16  [MA05-2]  70.99,171.45 0 top
SV17  [MA05-2]  55.75,166.37 0 top
SV18  [MA05-2]  70.99,166.37 0 top
SV19  [MA05-2]  55.75,161.29 0 top
SV20  [MA05-2]  70.99,161.29 0 top
SV21  [MA05-2]  55.75,156.21 0 top
SV22  [MA05-2]  70.99,156.21 0 top
SV23  [MA05-2]  55.75,151.13 0 top
SV24  [MA05-2]  70.99,151.13 0 top
SV25  [MA05-2]  55.75,146.05 0 top
SV26  [MA05-2]  70.99,146.05 0 top
SV27  [MA05-2]  55.75,140.97 0 top
SV28  [MA05-2]  70.99,140.97 0 top
SV29  [MA05-2]  55.75,135.89 0 top
SV30  [MA05-2]  70.99,135.89 0 top
SV31  [MA05-2]  55.75,130.81 0 top
SV32  [MA05-2]  70.99,130.81 0 top
SV33  [MA05-2]  55.75,125.73 0 top
SV34  [MA05-2]  70.99,125.73 0 top
SV35  [MA05-2]  55.75,120.65 0 top
SV36  [MA05-2]  70.99,120.65 0 top
SV37  [MA05-2]  55.75,115.57 0 top
SV38  [MA05-2]  70.99,115.57 0 top
SV39  [MA05-2]  55.75,110.49 0 top
SV40  [MA05-2]  70.99,110.49 0 top
SV41  [MA05-2]  55.75,105.41 0 top
SV42  [MA05-2]  70.99,105.41 0 top
SV43  [MA05-2]  55.75,100.33 0 top
SV44  [MA05-2]  70.99,100.33 0 top
SV45  [MA05-2]  55.75,95.25 0 top
SV46  [MA05-2]  70.99,95.25 0 top
SV47  [MA05-2]  55.75,90.17 0 top
SV48  [MA05-2]  70.99,90.17 0 top
SV49  [MA05-2]  55.75,85.09 0 top
SV50  [MA05-2]  70.99,85.09 0 top
SV51  [MA05-2]  55.75,80.01 0 top
SV52  [MA05-2]  70.99,80.01 0 top
SV53  [MA05-2]  55.75,74.93 0 top
SV54  [MA05-2]  70.99,74.93 0 top
SV55  [MA05-2]  55.75,69.85 0 top
SV56  [MA05-2]  70.99,69.85 0 top
SV57  [MA05-2]  55.75,64.77 0 top
SV58  [MA05-2]  70.99,64.77 0 top
SV59  [MA05-2]  55.75,59.69 0 top
SV60  [MA05-2]  70.99,59.69 0 top
SV61  [MA05-2]  55.75,54.61 0 top
SV62  [MA05-2]  70.99,54.61 0 top
SV63  [MA05-2]  55.75,49.53 0 top
SV64  [MA05-2]  70.99,49.53 0 top
SV65  [MA05-2]  55.75,44.45 0 top
SV66  [MA05-2]  70.99,44.45 0 top
SV67  [MA05-2]  86.23,186.69 0 top
SV68  [MA05-2]  101.47,186.69 0 top
SV69  [MA05-2]  86.23,181.61 0 top
SV70  [MA05-2]  101.47,181.61 0 top
SV71  [MA05-2]  86.23,176.53 0 top
SV72  [MA05-2]  101.47,176.53 0 top
SV73  [MA05-2]  86.23,171.45 0 top
SV74  [MA05-2]  101.47,171.45 0 top
SV75  [MA05-2]  86.23,166.37 0 top
SV76  [MA05-2]  101.47,166.37 0 top
SV77  [MA05-2]  86.23,161.29 0 top
SV78  [MA05-2]  101.47,161.29 0 top
SV79  [MA05-2]  86.23,156.21 0 top
SV80  [MA05-2]  101.47,156.21 0 top
SV81  [MA05-2]  86.23,151.13 0 top
SV82  [MA05-2]  101.47,151.13 0 top
SV83  [MA05-2]  86.23,146.05 0 top
SV84  [MA05-2]  101.47,146.05 0 top
SV85  [MA05-2]  86.23,140.97 0 top
SV86  [MA05-2]  101.47,140.97 0 top
SV87  [MA05-2]  86.23,135.89 0 top
SV88  [MA05-2]  101.47,135.89 0 top
SV89  [MA05-2]  86.23,130.81 0 top
SV90  [MA05-2]  101.47,130.81 0 top
SV91  [MA05-2]  86.23,125.73 0 top
SV92  [MA05-2]  101.47,125.73 0 top
SV93  [MA05-2]  86.23,120.65 0 top
SV94  [MA05-2]  101.47,120.65 0 top
SV95  [MA05-2]  86.23,115.57 0 top
SV96  [MA05-2]  101.47,115.57 0 top
SV97  [MA05-2]  86.23,110.49 0 top
SV98  [MA05-2]  101.47,110.49 0 top
SV99  [MA05-2]  86.23,105.41 0 top
SV100  [MA05-2]  101.47,105.41 0 top
SV101  [MA05-2]  86.23,100.33 0 top
SV102  [MA05-2]  101.47,100.33 0 top
SV103  [MA05-2]  86.23,95.25 0 top
SV104  [MA05-2]  101.47,95.25 0 top
SV105  [MA05-2]  86.23,90.17 0 top
SV106  [MA05-2]  101.47,90.17 0 top
SV107  [MA05-2]  86.23,85.09 0 top
SV108  [MA05-2]  101.47,85.09 0 top
SV109  [MA05-2]  86.23,80.01 0 top
SV110  [MA05-2]  101.47,80.01 0 top
SV111  [MA05-2]  86.23,74.93 0 top
SV112  [MA05-2]  101.47,74.93 0 top
SV113  [MA05-2]  86.23,69.85 0 top
SV114  [MA05-2]  101.47,69.85 0 top
SV115  [MA05-2]  86.23,64.77 0 top
SV116  [MA05-2]  101.47,64.77 0 top
SV117  [MA05-2]  86.23,59.69 0 top
SV118  [MA05-2]  101.47,59.69 0 top
SV119  [MA05-2]  86.23,54.61 0 top
SV120  [MA05-2]  101.47,54.61 0 top
SV121  [MA05-2]  86.23,49.53 0 top
SV122  [MA05-2]  101.47,49.53 0 top
SV123  [MA05-2]  86.23,44.45 0 top
SV124  [MA05-2]  101.47,44.45 0 top
SV125  [MA20-1]  93.85,163.83 270 top
SV126  [MA05-2]  162.43,186.69 0 top
SV127  [MA08-1]  93.85,52.07 270 top
SV128  [MA05-2]  162.43,181.61 0 top
SV129  [MA10-1]  93.85,74.93 270 top
SV130  [MA05-2]  162.43,176.53 0 top
SV131  [MA20-1]  93.85,113.03 270 top
SV132  [MA05-2]  162.43,171.45 0 top
SV133  [MA05-2]  162.43,166.37 0 top
SV134  [MA05-2]  177.67,186.69 0 top
SV135  [MA05-2]  177.67,181.61 0 top
SV136  [MA05-2]  177.67,176.53 0 top
SV137  [MA05-2]  177.67,171.45 0 top
SV138  [MA05-2]  177.67,166.37 0 top
SV139  [MA05-2]  162.43,161.29 0 top
SV140  [MA05-2]  177.67,161.29 0 top
SV141  [MA05-2]  162.43,156.21 0 top
SV142  [MA05-2]  177.67,156.21 0 top
SV143  [MA05-2]  162.43,151.13 0 top
SV144  [MA05-2]  177.67,151.13 0 top
SV145  [MA05-2]  162.43,146.05 0 top
SV146  [MA05-2]  177.67,146.05 0 top
SV147  [MA05-2]  162.43,140.97 0 top
SV148  [MA05-2]  177.67,140.97 0 top
SV149  [MA05-2]  162.43,135.89 0 top
SV150  [MA05-2]  177.67,135.89 0 top
SV151  [MA05-2]  162.43,130.81 0 top
SV152  [MA05-2]  177.67,130.81 0 top
SV153  [MA05-2]  162.43,125.73 0 top
SV154  [MA05-2]  177.67,125.73 0 top
SV155  [MA05-2]  162.43,120.65 0 top
SV156  [MA05-2]  177.67,120.65 0 top
SV157  [MA05-2]  162.43,115.57 0 top
SV158  [MA05-2]  177.67,115.57 0 top
SV159  [MA05-2]  192.91,186.69 0 top
SV160  [MA05-2]  208.15,186.69 0 top
SV161  [MA05-2]  192.91,181.61 0 top
SV162  [MA05-2]  208.15,181.61 0 top
SV163  [MA05-2]  192.91,176.53 0 top
SV164  [MA05-2]  208.15,176.53 0 top
SV165  [MA05-2]  192.91,171.45 0 top
SV166  [MA05-2]  208.15,171.45 0 top
SV167  [MA05-2]  208.15,166.37 0 top
SV168  [MA05-2]  192.91,166.37 0 top
SV169  [MA05-2]  192.91,161.29 0 top
SV170  [MA05-2]  208.15,161.29 0 top
SV171  [MA05-2]  192.91,156.21 0 top
SV172  [MA05-2]  208.15,156.21 0 top
SV173  [MA05-2]  192.91,151.13 0 top
SV174  [MA05-2]  208.15,151.13 0 top
SV175  [MA20-1]  170.05,163.83 270 top
SV176  [MA20-1]  185.29,163.83 270 top
SV177  [MA08-1]  200.53,179.07 270 top
SV178  [MA08-1]  200.53,158.75 270 top
SV179  [MA10-1]  170.05,125.73 90 top
SV180  [MA10-1]  185.29,125.73 270 top
U$1  OUTLINE-OMNIBUS  [OMNIBUS]  -0.13,0 0 top
U$2  [EDGE-CON8]  -0.13,0 0 top
VCC1  [JP1]  18.92,191.77 90 top
VCC2  [JP1]  18.92,166.37 90 top
VCC3  [JP1]  18.92,140.97 90 top
VCC4  [JP1]  18.92,115.57 90 top
VCC5  [JP1]  18.92,90.17 90 top
VCC6  [JP1]  18.92,64.77 90 top
VCC7  [JP1]  18.92,39.37 90 top
VCC8  [JP1]  41.78,191.77 90 top
VCC9  [JP1]  41.78,166.37 90 top
VCC10  [JP1]  41.78,140.97 90 top
VCC11  [JP1]  41.78,115.57 90 top
VCC12  [JP1]  41.78,90.17 90 top
VCC13  [JP1]  41.78,64.77 90 top
VCC14  [JP1]  41.78,39.37 90 top
VCC15  [JP1]  67.18,191.77 90 top
VCC16  [JP1]  82.42,191.77 90 top
VCC17  [JP1]  97.66,191.77 90 top
VCC18  [JP1]  67.18,39.37 90 top
VCC19  [JP1]  82.42,39.37 90 top
VCC20  [JP1]  97.66,39.37 90 top
VCC21  [JP1]  125.6,191.77 90 top
VCC22  [JP1]  125.6,166.37 90 top
VCC23  [JP1]  125.6,140.97 90 top
VCC24  [JP1]  125.6,115.57 90 top
VCC25  [JP1]  125.6,90.17 90 top
VCC26  [JP1]  125.6,64.77 90 top
VCC27  [JP1]  125.6,39.37 90 top
VCC28  [JP1]  148.46,191.77 90 top
VCC29  [JP1]  148.46,166.37 90 top
VCC30  [JP1]  148.46,140.97 90 top
VCC31  [JP1]  148.46,90.17 90 top
VCC32  [JP1]  148.46,115.57 90 top
VCC33  [JP1]  148.46,64.77 90 top
VCC34  [JP1]  173.86,191.77 90 top
VCC35  [JP1]  173.86,110.49 90 top
VCC36  [JP1]  204.34,191.77 90 top
VCC37  [JP1]  204.34,146.05 90 top
VCC38  [JP1]  232.28,191.77 90 top
VCC39  [JP1]  232.28,166.37 90 top
VCC40  [JP1]  232.28,140.97 90 top
VCC41  [JP1]  255.14,166.37 90 top
VCC42  [JP1]  255.14,140.97 90 top
VCC43  [JP1]  255.14,115.57 90 top
VCC44  [JP1]  232.28,115.57 90 top

## Tracks (layer width: path | path; a pad name or v marks a point on that pad's centre or on a via)
!6131  (1 unrouted)
!6132  (1 unrouted)
!6133  (2 unrouted)
!BREAK_CYCLE
  Bottom 0.406: D8.10 163.07,22.23 164.34,20.95 164.34,15.88 163.07,14.61 U$2.BL2
!BRK_DATA_CONT
  Bottom 0.406: D8.9 166.24,22.23 167.51,20.95 167.51,15.88 166.24,14.61 U$2.BK2
!BRK_IN_PROG
  Bottom 0.406: D8.5 177.04,23.5 177.04,15.88 178.31,14.61 U$2.BE2
!BUS_STROBE
  Top 0.406: D11.9 102.11,19.68 102.11,13.97 U$2.CK1
!C0
  Top 0.406: D11.5 114.81,19.68 114.81,13.97 U$2.CE1
!C1
  Top 0.406: D11.7 108.46,19.68 108.46,13.97 U$2.CH1
!C2
  Top 0.406: D11.8 105.28,19.68 105.28,13.97 U$2.CJ1
!CE
  Top 0.406: Q1.1 249.43,100.33 250.7,101.6 C2.1 256.41,99.69 258.95,97.16 258.95,85.09 210.06,85.09 208.79,83.82 IC3.20 207.52,83.82 206.25,82.55 179.58,82.55 178.31,83.82 IC4.20
  Bottom 0.406: C2.1 R7.1
!CPMA_DISABLE
  Top 0.406: D11.17 76.71,19.68 76.71,13.97 U$2.CU1
!D
  Bottom 0.406: D14.9 32.89,24.77 34.16,23.5 34.16,15.88 32.89,14.61 U$2.DK2
!DATA0
  Top 0.406: D9.14 219.58,19.68 219.58,13.97 U$2.AR1
!DATA1
  Top 0.406: D9.15 216.41,19.68 216.41,13.97 U$2.AS1
!DATA2
  Top 0.406: D9.17 210.06,19.68 210.06,13.97 U$2.AU1
!DATA3
  Top 0.406: D9.18 206.88,19.68 206.88,13.97 U$2.AV1
!DATA4
  Top 0.406: D7.14 149.73,19.68 149.73,13.97 U$2.BR1
!DATA5
  Top 0.406: D7.15 146.56,19.68 146.56,13.97 U$2.BS1
!DATA6
  Top 0.406: D7.17 140.21,19.68 140.21,13.97 U$2.BU1
!DATA7
  Top 0.406: D7.18 137.03,19.68 137.03,13.97 U$2.BV1
!DATA8
  Top 0.406: D13.14 16.38,19.68 16.38,13.97 U$2.DR1
!DATA9
  Top 0.406: D13.15 13.21,19.68 13.21,13.97 U$2.DS1
!DATA10
  Top 0.406: D13.17 6.86,19.68 6.86,13.97 U$2.DU1
!DATA11
  Top 0.406: D13.18 3.68,19.68 3.68,13.97 U$2.DV1
!E
  Bottom 0.406: D14.10 29.72,22.23 30.99,20.95 30.99,15.88 29.72,14.61 U$2.DL2
!EMA0  (via drill 0.81)
  Top 0.406: IC3.8 179.58,86.36 178.31,87.63 164.34,87.63 163.07,86.36 IC4.8 161.16,85.09 161.16,80.64 161.8,80.01 208.79,80.01 214.5,74.3 | 214.5,74.3 v219.58,69.22 | v251.33,41.27 251.33,73.03 246.89,77.47 229.11,77.47 224.03,82.55 222.76,82.55 214.5,74.3
  Bottom 0.406: U$2.AD2 251.97,14.61 253.24,15.88 253.24,23.5 251.97,24.77 D10.4 251.33,26.04 v251.33,41.27 | IC5.3 224.66,54.61 224.66,69.22 224.03,69.85 220.22,69.85 v219.58,69.22
!EMA1  (via drill 0.81)
  Top 0.406: IC4.9 174.5,83.82 175.77,85.09 178.31,85.09 179.58,83.82 IC3.9 193.55,83.82 194.82,85.09 v205.61,85.09 | v232.92,36.2 v227.2,36.2 | v248.79,30.48 v232.92,30.48 | v227.2,55.88 IC5.2 v219.58,55.88 | v219.58,63.5 v205.61,63.5
  Bottom 0.406: v227.2,36.2 v227.2,55.88 | v232.92,30.48 v232.92,36.2 | v248.79,30.48 D10.5 248.79,22.86 250.06,21.59 250.06,15.88 248.79,14.61 U$2.AE2 | v205.61,63.5 v205.61,85.09 | v219.58,55.88 v219.58,63.5
!EMA2  (via drill 0.81)
  Top 0.406: v242.44,31.75 208.15,31.75 v206.88,33.02 | IC4.10 163.07,81.28 164.34,82.55 178.31,82.55 179.58,81.28 IC3.10 | IC5.1 222.12,57.15 218.31,57.15 v214.5,53.34
  Bottom 0.406: U$2.AH2 242.44,14.61 243.71,15.88 243.71,20.95 242.44,22.23 D10.7 242.19,31.5 v242.44,31.75 | v214.5,53.34 214.5,40.64 v206.88,33.02 199.26,25.4 192.91,25.4 192.91,69.22 191.64,70.48 191.64,79.38 192.91,80.64 IC3.10
!F
  Bottom 0.406: D14.8 36.07,24.77 37.34,23.5 37.34,15.88 36.07,14.61 U$2.DJ2
!FSET
  Bottom 0.406: D14.13 18.29,23.5 18.29,15.88 19.56,14.61 U$2.DP2
!HHLHLX  (2 unrouted)
!IND1
  Bottom 0.406: D12.17 77.34,24.77 78.61,23.5 78.61,15.88 77.34,14.61 U$2.CU2
!IND2
  Bottom 0.406: D12.18 74.17,24.77 75.44,23.5 75.44,15.88 74.17,14.61 U$2.CV2
!INT_RQST  (1 unrouted)
  Top 0.406: D11.13 89.41,19.68 89.41,13.97 U$2.CP1
!INTERNAL_IO  (1 unrouted)
  Top 0.406: D11.10 98.93,19.68 98.93,13.97 U$2.CL1
!IO_PAUSE  (1 unrouted)
  Top 0.406: D11.4 117.98,19.68 117.98,13.97 U$2.CD1
!IR0
  Bottom 0.406: D14.4 46.86,23.5 46.86,15.88 48.13,14.61 U$2.DD2
!IR1
  Bottom 0.406: D14.5 43.69,23.5 43.69,15.88 44.96,14.61 U$2.DE2
!IR2
  Bottom 0.406: D14.7 39.24,24.77 40.51,23.5 40.51,15.88 39.24,14.61 U$2.DH2
!IRQ_ENABLE  (1 unrouted)
!KEY_CONT
  Bottom 0.406: D14.17 7.49,24.77 8.76,23.5 8.76,15.88 7.49,14.61 U$2.DU2
!LA_ENABLE
  Bottom 0.406: D8.11 159.89,22.23 161.16,20.95 161.16,15.88 159.89,14.61 U$2.BM2
!LINK
  Bottom 0.406: D10.18 207.52,24.77 208.79,23.5 208.79,15.88 207.52,14.61 U$2.AV2
!LINK_DATA
  Bottom 0.406: D12.14 84.96,23.5 84.96,15.88 86.23,14.61 U$2.CR2
!LINK_LOAD
  Bottom 0.406: D12.15 81.79,23.5 81.79,15.88 83.06,14.61 U$2.CS2
!LOAD_CONT
  Bottom 0.406: D8.7 172.59,24.77 173.86,23.5 173.86,15.88 172.59,14.61 U$2.BH2
!MA00  (via drill 0.81)
  Top 0.406: IC4.21 178.31,86.36 179.58,85.09 193.55,85.09 194.82,86.36 IC3.21 | U$2.AD1 251.33,13.97 251.33,19.68 D9.4 251.97,20.95 252.6,21.59 262.76,21.59 262.76,99.69 257.05,105.41 255.78,105.41 250.7,110.49 235.46,110.49 v232.92,107.95
  Bottom 0.406: v232.92,107.95 232.92,92.71 207.52,92.71 206.88,92.08 206.88,88.27 208.15,87 IC3.21
!MA01  (via drill 0.81)
  Top 0.406: IC4.23 178.31,91.44 179.58,90.17 206.25,90.17 207.52,91.44 IC3.23 | U$2.AE1 248.16,13.97 248.16,19.68 D9.5 248.16,20.95 247.52,21.59 216.41,21.59 v215.14,22.86
  Bottom 0.406: v215.14,22.86 215.14,26.04 215.77,26.67 215.77,83.19 208.15,90.81 IC3.23
!MA02  (via drill 0.81)
  Top 0.406: IC4.24 178.31,93.98 179.58,92.71 206.25,92.71 207.52,93.98 IC3.24 208.79,93.98 212.6,90.17 v238.63,90.17 | D9.7 241.81,19.68 241.81,13.97 U$2.AH1
  Bottom 0.406: v238.63,90.17 240.54,88.27 240.54,22.23 241.81,20.95 D9.7
!MA03  (via drill 0.81)
  Top 0.406: IC4.25 178.31,96.52 179.58,95.25 206.25,95.25 207.52,96.52 IC3.25 208.79,96.52 213.87,91.44 v235.46,91.44 | D9.8 238.63,19.68 238.63,13.97 U$2.AJ1
  Bottom 0.406: v235.46,91.44 237.36,89.53 237.36,22.23 238.63,20.95 D9.8
!MA04  (via drill 0.81)
  Top 0.406: IC4.26 178.31,99.06 179.58,97.79 v187.83,97.79 204.98,97.79 206.25,99.06 IC3.26 | D7.4 181.48,19.68 181.48,13.97 U$2.BD1
  Bottom 0.406: v187.83,97.79 187.83,30.48 183.39,26.04 183.39,22.23 182.12,20.95 D7.4
!MA05
  Top 0.406: IC4.1 163.07,104.14 164.34,105.41 191.01,105.41 192.28,104.14 IC3.1 | D7.5 178.31,19.68 178.31,13.97 U$2.BE1
  Bottom 0.406: IC3.1 187.83,104.14 186.56,102.87 186.56,32.38 180.21,26.04 180.21,24.77 178.94,23.5 178.94,20.95 D7.5
!MA06
  Top 0.406: IC4.2 163.07,101.6 164.34,102.87 178.31,102.87 179.58,101.6 IC3.2 | D7.7 171.96,19.68 171.96,13.97 U$2.BH1
  Bottom 0.406: IC4.2 162.43,100.97 171.32,92.08 171.32,26.67 170.69,26.04 170.69,22.23 171.96,20.95 D7.7
!MA07
  Top 0.406: IC4.3 163.07,99.06 164.34,100.33 178.31,100.33 179.58,99.06 IC3.3 | D7.8 168.78,19.68 168.78,13.97 U$2.BJ1
  Bottom 0.406: IC4.3 162.43,98.42 168.78,92.08 168.78,27.3 167.51,26.04 167.51,22.23 168.78,20.95 D7.8
!MA08  (via drill 0.81)
  Top 0.406: IC3.4 179.58,96.52 178.31,97.79 164.34,97.79 163.07,96.52 IC4.4 159.89,93.98 159.89,66.04 128.78,34.92 v50.04,34.92 | D13.4 48.13,19.68 48.13,13.97 U$2.DD1
  Bottom 0.406: D13.4 48.51,20.7 50.04,22.23 v50.04,34.92
!MA09  (via drill 0.81)
  Top 0.406: IC4.5 163.07,93.98 164.34,95.25 178.31,95.25 179.58,93.98 IC3.5 | D13.5 44.96,19.68 44.96,13.97 U$2.DE1 | v156.08,64.77 156.08,63.5 128.78,36.2 v46.86,36.2
  Bottom 0.406: IC4.5 156.08,88.9 v156.08,64.77 | v46.86,36.2 46.86,24.77 45.59,23.5 45.59,20.95 D13.5
!MA10  (via drill 0.81)
  Top 0.406: IC4.6 163.07,91.44 164.34,92.71 178.31,92.71 179.58,91.44 IC3.6 | U$2.DH1 38.61,13.97 38.61,19.68 D13.7 39.24,20.95 39.88,21.59 v130.68,21.59
  Bottom 0.406: v130.68,21.59 149.73,40.64 149.73,45.72 151,46.99 153.54,46.99 157.35,51.44 157.35,86.36 IC4.6
!MA11  (via drill 0.81)
  Top 0.406: IC4.7 163.07,88.9 164.34,90.17 178.31,90.17 179.58,88.9 IC3.7 | U$2.DJ1 35.43,13.97 35.43,19.68 D13.8 36.07,20.95 37.34,22.23 37.34,26.04 39.88,28.57 136.4,28.57 137.03,29.21 140.21,29.21 v159.26,48.26
  Bottom 0.406: v159.26,48.26 159.26,85.09 162.43,88.27 IC4.7
!MD00  (via drill 0.81)
  Top 0.406: v220.85,59.69 197.36,59.69 196.72,60.33 195.45,60.33 IC1.2 | v220.85,34.92 v234.19,34.92 | U$2.AK1 236.09,13.97 236.09,19.68 D9.9
  Bottom 0.406: v220.85,34.92 v220.85,59.69 | v234.19,34.92 234.19,22.23 235.46,20.95 D9.9
!MD01  (via drill 0.81)
  Top 0.406: v231.65,38.73 232.28,39.37 232.28,48.9 231.65,49.53 230.38,49.53 227.84,52.07 202.44,52.07 196.09,58.42 IC1.3 | U$2.AL1 232.28,13.97 232.28,19.68 D9.10
  Bottom 0.406: v231.65,38.73 231.01,38.1 231.01,22.23 D9.10
!MD02  (via drill 0.81)
  Top 0.406: v224.66,29.21 201.8,29.21 201.8,46.35 196.09,52.07 194.18,52.07 194.18,53.98 195.45,55.24 IC1.4 | U$2.AM1 229.11,13.97 229.11,19.68 D9.11
  Bottom 0.406: v224.66,29.21 227.84,26.04 227.84,22.23 229.11,20.95 D9.11
!MD03  (via drill 0.81)  (1 unrouted)
  Top 0.406: v217.04,46.99 202.44,46.99 196.09,53.34 IC1.5 | U$2.AP1 222.76,13.97 222.76,19.68 D9.13
  Bottom 0.406: v217.04,46.99 219.58,44.45 219.58,27.94 221.49,26.04 221.49,22.23 222.76,20.95 D9.13
!MD04  (via drill 0.81)  (1 unrouted)
  Top 0.406: v167.51,29.21 199.26,29.21 199.26,46.35 195.45,50.16 IC1.6 | U$2.BK1 165.61,13.97 165.61,19.68 D7.9
  Bottom 0.406: v167.51,29.21 164.34,26.04 164.34,22.23 165.61,20.95 D7.9
!MD05  (via drill 0.81)  (1 unrouted)
  Top 0.406: v167.51,32.38 196.72,32.38 196.72,46.35 195.45,47.62 IC1.7 | U$2.BL1 162.43,13.97 162.43,19.68 D7.10
  Bottom 0.406: v167.51,32.38 161.16,26.04 161.16,22.23 162.43,20.95 D7.10
!MD06  (via drill 0.81)  (1 unrouted)
  Top 0.406: v167.51,36.83 173.23,36.83 180.85,44.45 193.55,44.45 194.82,45.72 IC1.8 | U$2.BM1 159.26,13.97 159.26,19.68 D7.11
  Bottom 0.406: v167.51,36.83 157.99,27.3 157.99,22.23 159.26,20.95 D7.11
!MD07  (via drill 0.81)  (1 unrouted)
  Top 0.406: v162.43,33.66 171.32,33.66 179.58,41.91 193.55,41.91 194.82,43.18 IC1.9 | U$2.BP1 152.91,13.97 152.91,19.68 D7.13
  Bottom 0.406: v162.43,33.66 154.81,26.04 154.81,22.23 153.54,20.95 D7.13
!MD08  (via drill 0.81)  (2 unrouted)
  Top 0.406: v37.34,32.38 128.78,32.38 157.35,60.96 IC2.2 | U$2.DK1 32.26,13.97 32.26,19.68 D13.9
  Bottom 0.406: v37.34,32.38 30.99,26.04 30.99,22.23 D13.9
!MD09  (via drill 0.81)  (1 unrouted)
  Top 0.406: v32.89,31.11 128.78,31.11 151,53.34 161.8,53.34 166.88,58.42 IC2.3 | U$2.DL1 29.08,13.97 29.08,19.68 D13.10
  Bottom 0.406: v32.89,31.11 27.81,26.04 27.81,22.23 29.08,20.95 D13.10
!MD10  (1 unrouted)
  Top 0.406: IC2.4 166.88,55.88 163.07,52.07 151,52.07 128.78,29.84 31.62,29.84 27.81,26.04 27.81,22.23 26.54,20.95 D13.11 25.91,19.68 25.91,13.97 U$2.DM1
!MD11  (1 unrouted)
  Top 0.406: IC2.5 168.15,53.34 169.42,54.61 175.77,54.61 176.4,55.24 176.4,59.69 170.69,59.69 168.15,62.23 157.35,62.23 128.78,33.66 29.08,33.66 21.46,26.04 21.46,22.23 20.19,20.95 D13.13 19.56,19.68 19.56,13.97 U$2.DP1
!MD_DIR  (via drill 0.81)  (5 unrouted)
  Top 0.406: IC8.2 196.72,135.89 204.34,135.89 215.77,124.46 215.77,118.11 219.58,114.3 230.38,114.3 v231.01,113.67
  Bottom 0.406: v231.01,113.67 234.19,110.49 234.19,86.36 235.46,85.09 235.46,26.04 D10.9 236.09,22.23 237.36,20.95 237.36,15.88 236.09,14.61 U$2.AK2 | IC8.2 192.91,134.62 C11.1
!MEM_START
  Bottom 0.406: D10.8 239.27,22.23 240.54,20.95 240.54,15.88 239.27,14.61 U$2.AJ2
!MS_DISABLE
  Top 0.406: D11.18 73.53,19.68 73.53,13.97 U$2.CV1
!NOT_LAST_TR
  Top 0.406: D11.11 95.76,19.68 95.76,13.97 U$2.CM1
!NTS_STALL
  Bottom 0.406: D8.14 148.46,23.5 148.46,15.88 149.73,14.61 U$2.BR2
!OVERFLOW
  Bottom 0.406: D8.8 169.42,22.23 170.69,20.95 170.69,15.88 169.42,14.61 U$2.BJ2
!READ_EN  (via drill 0.81)  (3 unrouted)
  Top 0.406: IC2.1 168.15,63.5 169.42,64.77 v177.04,64.77 193.55,64.77 194.82,63.5 IC1.1 | IC4.22 178.31,88.9 179.58,87.63 206.25,87.63 207.52,88.9 IC3.22 239.9,88.9 239.9,90.81 238,92.71 232.92,92.71 231.65,93.98
  Bottom 0.406: v177.04,64.77 177.04,69.22 176.4,69.85 176.4,87 177.67,88.27 IC4.22
!ROM_ADDR  (via drill 0.81)
  Top 0.406: v214.5,36.2 223.39,45.09 IC5.6
  Bottom 0.406: v214.5,36.2 210.69,32.38 D10.17 210.69,24.77 211.96,23.5 211.96,15.88 210.69,14.61 U$2.AU2
!RUN
  Bottom 0.406: D8.17 140.84,24.77 142.11,23.5 142.11,15.88 140.84,14.61 U$2.BU2
!SKIP  (1 unrouted)
  Top 0.406: D11.15 83.06,19.68 83.06,13.97 U$2.CS1
!SOURCE
  Top 0.406: IC8.7 IC8.14
!STOP
  Bottom 0.406: D14.15 11.94,23.5 11.94,15.88 13.21,14.61 U$2.DS2
!TS1
  Bottom 0.406: D12.9 102.74,24.77 104.01,23.5 104.01,15.88 102.74,14.61 U$2.CK2
!TS2
  Bottom 0.406: D12.10 97.66,23.5 97.66,15.88 98.93,14.61 U$2.CL2
!TS3
  Bottom 0.406: D12.11 94.49,23.5 94.49,15.88 95.76,14.61 U$2.CM2
!TS4
  Bottom 0.406: D12.13 88.14,23.5 88.14,15.88 89.41,14.61 U$2.CP2
!USER_MODE
  Bottom 0.406: D14.11 24.64,23.5 24.64,15.88 25.91,14.61 U$2.DM2
!WRITE_EN  (2 unrouted)
  Top 0.406: IC4.27 178.31,101.6 179.58,100.33 206.25,100.33 207.52,101.6 IC3.27
  Bottom 0.406: IC3.27 213.23,96.52 IC7.6
+15V
  Bottom 0.406: D14.1 56.39,23.5 56.39,15.88 57.66,14.61 U$2.DA2
-15V  (via drill 0.81)
  Top 0.813: D14.2 55.12,26.04 56.39,27.3 123.06,27.3 D12.2 124.97,26.04 126.24,27.3 137.03,27.3 137.67,27.94 187.83,27.94 | 187.83,27.94 187.83,26.04 D8.2 | v255.78,27.94 187.83,27.94
  Bottom 0.813: U$2.AB2 258,14.61 256.73,15.88 256.73,23.81 D10.2 v255.78,27.94 | D8.2 186.88,23.81 186.88,16.19 187.83,15.24 U$2.BB2 | D14.2 53.53,23.81 53.53,15.88 54.8,14.61 U$2.DB2 | D12.2 123.38,23.81 123.38,15.88 124.65,14.61 U$2.CB2
DISABLE  (via drill 0.81)  (4 unrouted)
  Top 0.406: v205.61,96.52 206.88,97.79 Q1.3 254.51,97.79 255.78,96.52 C2.2
  Bottom 0.406: IC6.8 250.06,44.45 250.06,65.41 248.79,66.67 Q1.3 | IC8.8 205.61,109.22 v205.61,96.52
EMEM0
  Bottom 0.406: IC2.11 184.02,49.53 184.02,74.3 177.67,80.64 IC4.19
EMEM1
  Bottom 0.406: IC2.12 175.13,43.81 182.12,50.8 182.12,73.66 177.67,78.11 IC4.18
EMEM2
  Bottom 0.406: IC2.13 175.13,46.35 180.85,52.07 180.85,72.39 177.67,75.56 IC4.17
EMEM3
  Bottom 0.406: IC2.14 179.58,52.7 179.58,71.75 IC4.16
GND  (via drill 0.81)  (89 unrouted)
  Top 0.813: GND20.1 GND20.2 | D11.12 92.58,19.68 92.58,13.97 U$2.CN2 | D13.6 41.78,19.68 41.78,13.97 U$2.DF2 | D13.3 51.31,19.68 51.31,13.97 U$2.DC2 | D11.16 79.88,19.68 79.88,13.97 U$2.CT2 | GND18.2 GND18.1 61.47,39.37 63.37,37.47 70.99,37.47 72.9,39.37 GND19.2 GND19.1 78.61,41.91 SV10.8 SV10.7 SV10.6 SV10.5 SV10.4 SV10.3 SV10.2 SV10.1 SV12.10 SV12.9 SV12.8 SV12.7 SV12.6 SV12.5 SV12.4 SV12.3 SV12.2 SV12.1 SV6.20 SV6.19 SV6.18 SV6.17 SV6.16 SV6.15 SV6.14 SV6.13 SV6.12 SV6.11 SV6.10 SV6.9 SV6.8 SV6.7 SV6.6 SV6.5 SV6.4 SV6.3 SV6.2 SV6.1 SV4.20 SV4.19 SV4.18 SV4.17 SV4.16 SV4.15 SV4.14 SV4.13 SV4.12 SV4.11 SV4.10 SV4.9 SV4.8 SV4.7 SV4.6 SV4.5 SV4.4 SV4.3 SV4.2 SV4.1 78.61,189.23 GND16.1 GND16.2 | D14.6 42.42,24.77 43.69,23.5 50.04,23.5 D14.3 | D9.3 254.51,19.68 254.51,13.97 U$2.AC1 | U$2.AF2 244.98,13.97 244.98,19.68 D9.6 | D10.3 253.24,23.5 246.89,23.5 245.62,24.77 D10.6 | U$2.AT2 213.23,13.97 213.23,19.68 D9.16 211.96,22.23 187.2,22.23 184.66,19.68 | 184.66,19.68 D7.3 | U$2.BC1 184.66,13.97 184.66,19.68 | D9.12 225.93,19.68 225.93,13.97 U$2.AN2 | IC4.14 163.07,71.12 164.97,69.22 v170.05,69.22 190.37,69.22 192.28,71.12 IC3.14 193.55,71.12 v195.45,69.22 | C4.2 197.99,65.41 202.44,60.96 IC1.19 C6.2 | 220.22,37.47 IC5.8 | 220.22,37.47 216.41,33.66 v213.87,33.66 | 220.22,37.47 242.44,37.47 245.62,40.64 IC6.7 | GND37.2 GND37.1 C9.2 IC8.1 SV180.1 | GND35.2 GND35.1 169.42,108.58 180.85,108.58 C1.2 185.29,109.22 SV180.10 | IC8.9 IC8.10 SV180.10 | SV180.10 SV180.9 SV180.8 SV180.7 SV180.6 SV180.5 SV180.4 SV180.3 SV180.2 SV180.1 | SV180.1 SV176.20 SV176.19 SV176.18 SV176.17 SV176.16 SV176.15 SV176.14 SV176.13 SV176.12 SV176.11 SV176.10 SV176.9 SV176.8 SV176.7 SV176.6 SV176.5 SV176.4 SV176.3 SV176.2 SV176.1